# EAGLE design arduino_drivershield_1l (EAGLE 6.2)
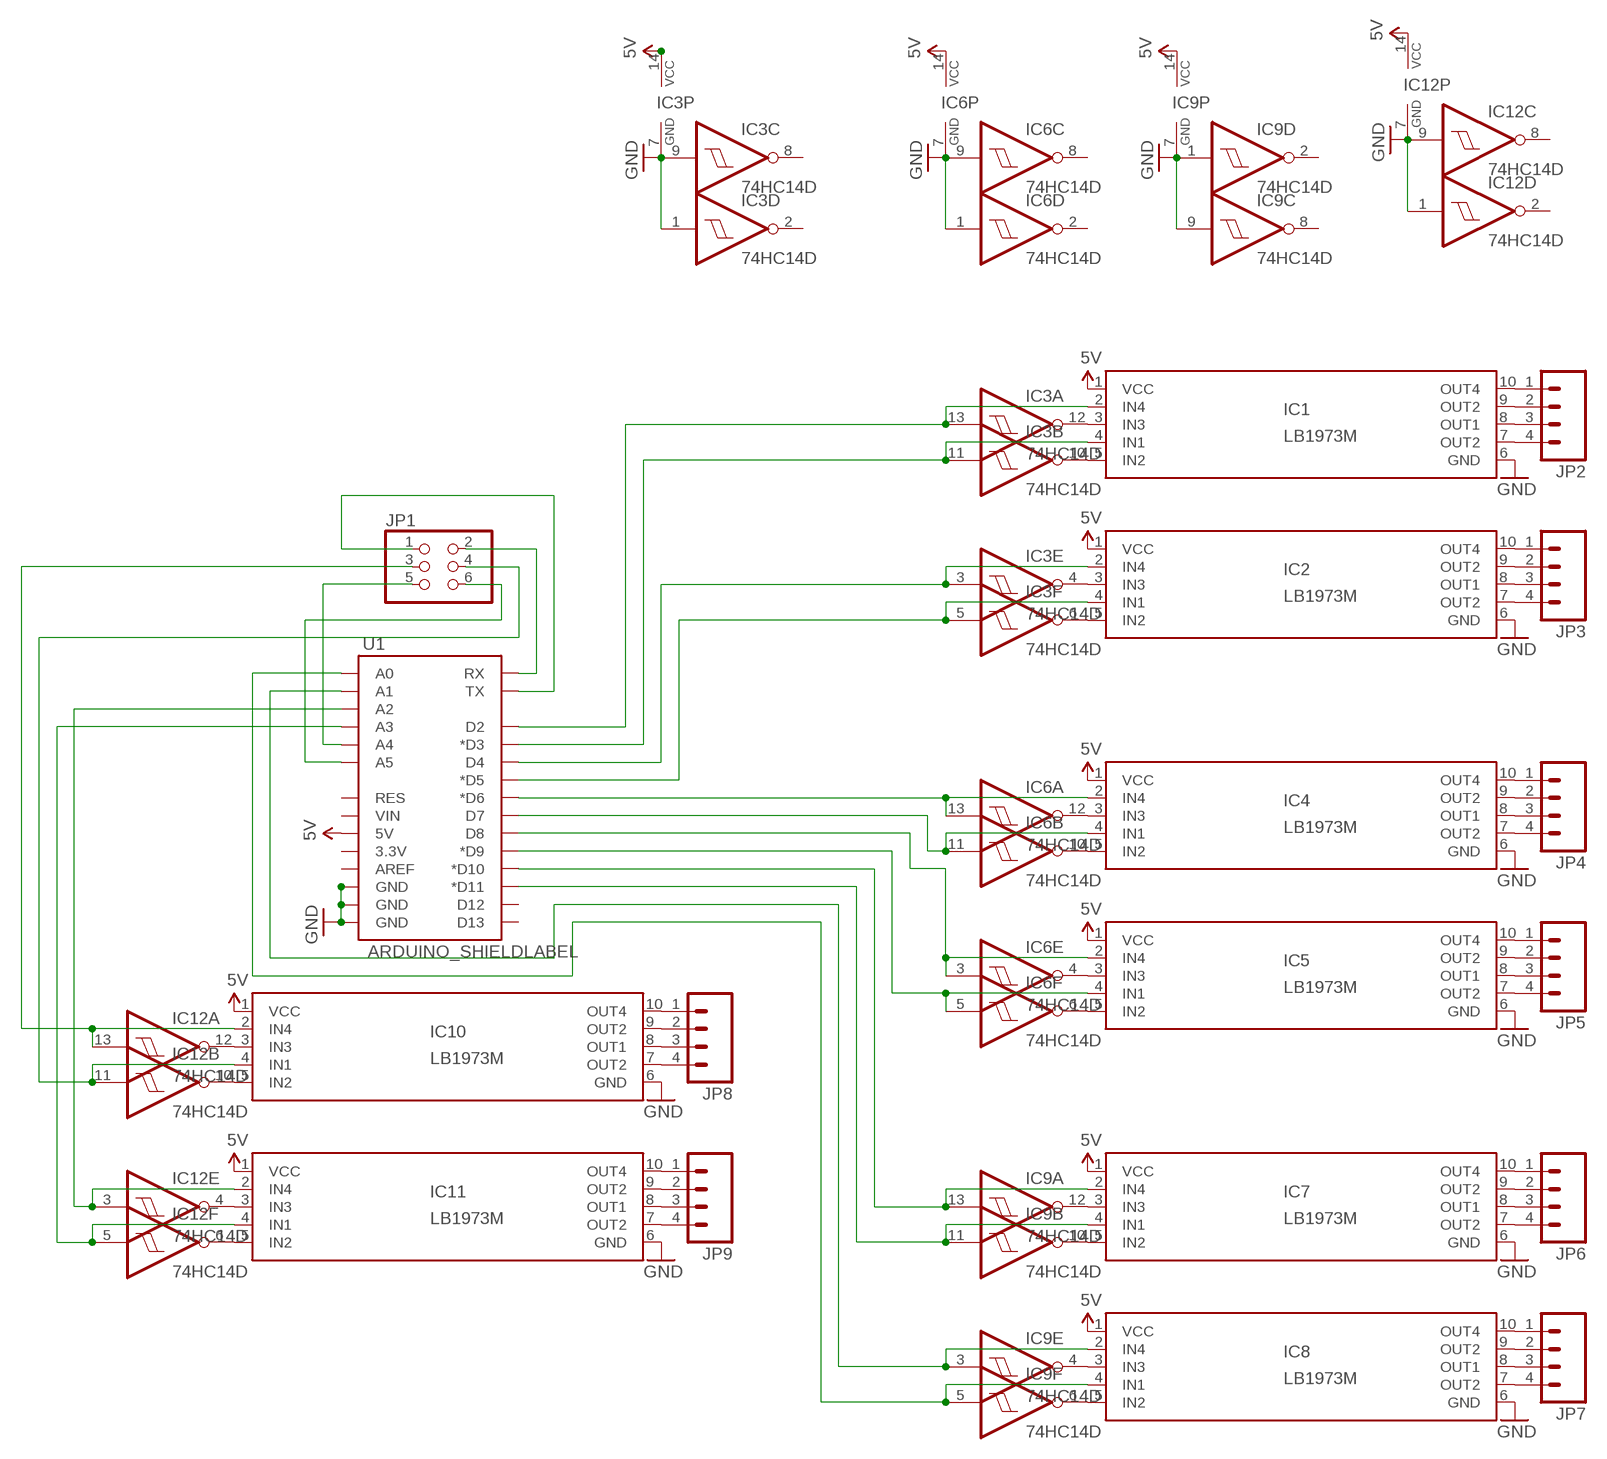
[diagram p0: schematic, sheet 1]

## Parts
IC1  LB1973M  [SSOP10]
IC2  LB1973M  [SSOP10]
IC3  74HC14D  [SO14]
IC4  LB1973M  [SSOP10]
IC5  LB1973M  [SSOP10]
IC6  74HC14D  [SO14]
IC7  LB1973M  [SSOP10]
IC8  LB1973M  [SSOP10]
IC9  74HC14D  [SO14]
IC10  LB1973M  [SSOP10]
IC11  LB1973M  [SSOP10]
IC12  74HC14D  [SO14]
JP1  PINHD-2X3  [2X03]
JP2  M041X04_NO_SILK  [1X04_NO_SILK]
JP3  M041X04_NO_SILK  [1X04_NO_SILK]
JP4  M041X04_NO_SILK  [1X04_NO_SILK]
JP5  M041X04_NO_SILK  [1X04_NO_SILK]
JP6  M041X04_NO_SILK  [1X04_NO_SILK]
JP7  M041X04_NO_SILK  [1X04_NO_SILK]
JP8  M041X04_NO_SILK  [1X04_NO_SILK]
JP9  M041X04_NO_SILK  [1X04_NO_SILK]
U1  ARDUINO_SHIELDLABEL  [DUEMILANOVE_SHIELD]

## Nets
5V: IC1.1(VCC) IC2.1(VCC) IC3.14(P:VCC) IC4.1(VCC) IC5.1(VCC) IC6.14(P:VCC) IC7.1(VCC) IC8.1(VCC) IC9.14(P:VCC) IC10.1(VCC) IC11.1(VCC) IC12.14(P:VCC) U1.5V
GND: IC1.6(GND) IC2.6(GND) IC3.1(D:I) IC3.7(P:GND) IC3.9(C:I) IC4.6(GND) IC5.6(GND) IC6.1(D:I) IC6.7(P:GND) IC6.9(C:I) IC7.6(GND) IC8.6(GND) IC9.1(D:I) IC9.7(P:GND) IC9.9(C:I) IC10.6(GND) IC11.6(GND) IC12.1(D:I) IC12.7(P:GND) IC12.9(C:I) U1.GND@0(GND) U1.GND@1(GND) U1.GND@2(GND)
N$1: IC1.7(OUT2) JP2.4
N$2: IC1.8(OUT1) JP2.3
N$3: IC1.9(OUT2) JP2.2
N$4: IC1.10(OUT4) JP2.1
N$5: IC2.7(OUT2) JP3.4
N$6: IC2.8(OUT1) JP3.3
N$7: IC2.9(OUT2) JP3.2
N$8: IC2.10(OUT4) JP3.1
N$9: IC1.3(IN3) IC3.12(A:O)
N$10: IC1.5(IN2) IC3.10(B:O)
N$11: IC2.3(IN3) IC3.4(E:O)
N$12: IC2.5(IN2) IC3.6(F:O)
N$13: IC1.4(IN1) IC3.11(B:I) U1.D3(*D3)
N$14: IC1.2(IN4) IC3.13(A:I) U1.D2
N$15: IC2.2(IN4) IC3.3(E:I) U1.D4
N$16: IC2.4(IN1) IC3.5(F:I) U1.D5(*D5)
N$17: IC4.7(OUT2) JP4.4
N$18: IC4.8(OUT1) JP4.3
N$19: IC4.9(OUT2) JP4.2
N$20: IC4.10(OUT4) JP4.1
N$21: IC5.7(OUT2) JP5.4
N$22: IC5.8(OUT1) JP5.3
N$23: IC5.9(OUT2) JP5.2
N$24: IC5.10(OUT4) JP5.1
N$25: IC4.3(IN3) IC6.12(A:O)
N$26: IC4.5(IN2) IC6.10(B:O)
N$27: IC10.2(IN4) IC12.13(A:I) JP1.3
N$28: IC8.2(IN4) IC9.3(E:I) U1.A1
N$29: IC10.4(IN1) IC12.11(B:I) JP1.4
N$30: IC11.2(IN4) IC12.3(E:I) U1.A2
N$33: IC4.4(IN1) IC6.11(B:I) U1.D7
N$34: IC4.2(IN4) IC6.13(A:I) U1.D6(*D6)
N$35: IC5.2(IN4) IC6.3(E:I) U1.D8
N$36: IC5.4(IN1) IC6.5(F:I) U1.D9(*D9)
N$37: IC5.3(IN3) IC6.4(E:O)
N$38: IC5.5(IN2) IC6.6(F:O)
N$39: IC7.7(OUT2) JP6.4
N$40: IC7.8(OUT1) JP6.3
N$41: IC7.9(OUT2) JP6.2
N$42: IC7.10(OUT4) JP6.1
N$43: IC8.7(OUT2) JP7.4
N$44: IC8.8(OUT1) JP7.3
N$45: IC8.9(OUT2) JP7.2
N$46: IC8.10(OUT4) JP7.1
N$47: IC7.3(IN3) IC9.12(A:O)
N$48: IC7.5(IN2) IC9.10(B:O)
N$49: IC7.4(IN1) IC9.11(B:I) U1.D11(*D11)
N$50: IC7.2(IN4) IC9.13(A:I) U1.D10(*D10)
N$51: IC8.4(IN1) IC9.5(F:I) U1.A0
N$53: IC8.3(IN3) IC9.4(E:O)
N$54: IC8.5(IN2) IC9.6(F:O)
N$55: IC10.7(OUT2) JP8.4
N$56: IC10.8(OUT1) JP8.3
N$57: IC10.9(OUT2) JP8.2
N$58: IC10.10(OUT4) JP8.1
N$59: IC11.7(OUT2) JP9.4
N$60: IC11.8(OUT1) JP9.3
N$61: IC11.9(OUT2) JP9.2
N$62: IC11.10(OUT4) JP9.1
N$63: IC10.3(IN3) IC12.12(A:O)
N$64: IC10.5(IN2) IC12.10(B:O)
N$66: IC11.4(IN1) IC12.5(F:I) U1.A3
N$69: IC11.3(IN3) IC12.4(E:O)
N$70: IC11.5(IN2) IC12.6(F:O)
RX: JP1.2 U1.RX
SCL: JP1.6 U1.A5
SDA: JP1.5 U1.A4
TX: JP1.1 U1.TX
Unconnected: IC3.2(D:O) IC3.8(C:O) IC6.2(D:O) IC6.8(C:O) IC9.2(D:O) IC9.8(C:O) IC12.2(D:O) IC12.8(C:O) U1.3.3V U1.AREF U1.D12 U1.D13 U1.RES U1.VIN

## Library data of the parts
IC1 IC2 IC4 IC5 IC7 IC8 IC10 IC11 = LB1973M:LB1973M: edit this description Auto generated by make-symbol-device-package-bsdl.ulp Rev. 43 Source:
IC3 IC6 IC9 IC12 = 74xx-eu:74*14: Hex schmitt trigger INVERTER
JP1 = SparkFun-Connectors:PINHD-2X3: PIN HEADER
JP2-JP9 = SparkFun-Connectors:M04: Header 4 Standard 4-pin 0.1" header. Use with straight break away headers (SKU : PRT-00116), right angle break away headers (PRT-00553), swiss pins (PRT-00743), machine pins (PRT-00117), and female headers (PRT-00115). Molex polarized connector foot print use with SKU : PRT-08231 with associated crimp pins and housings. 1MM SMD Version SKU: PRT-10208
U1 = SparkFun-Boards:ARDUINO_SHIELD: Arduino shield footprint

## Board
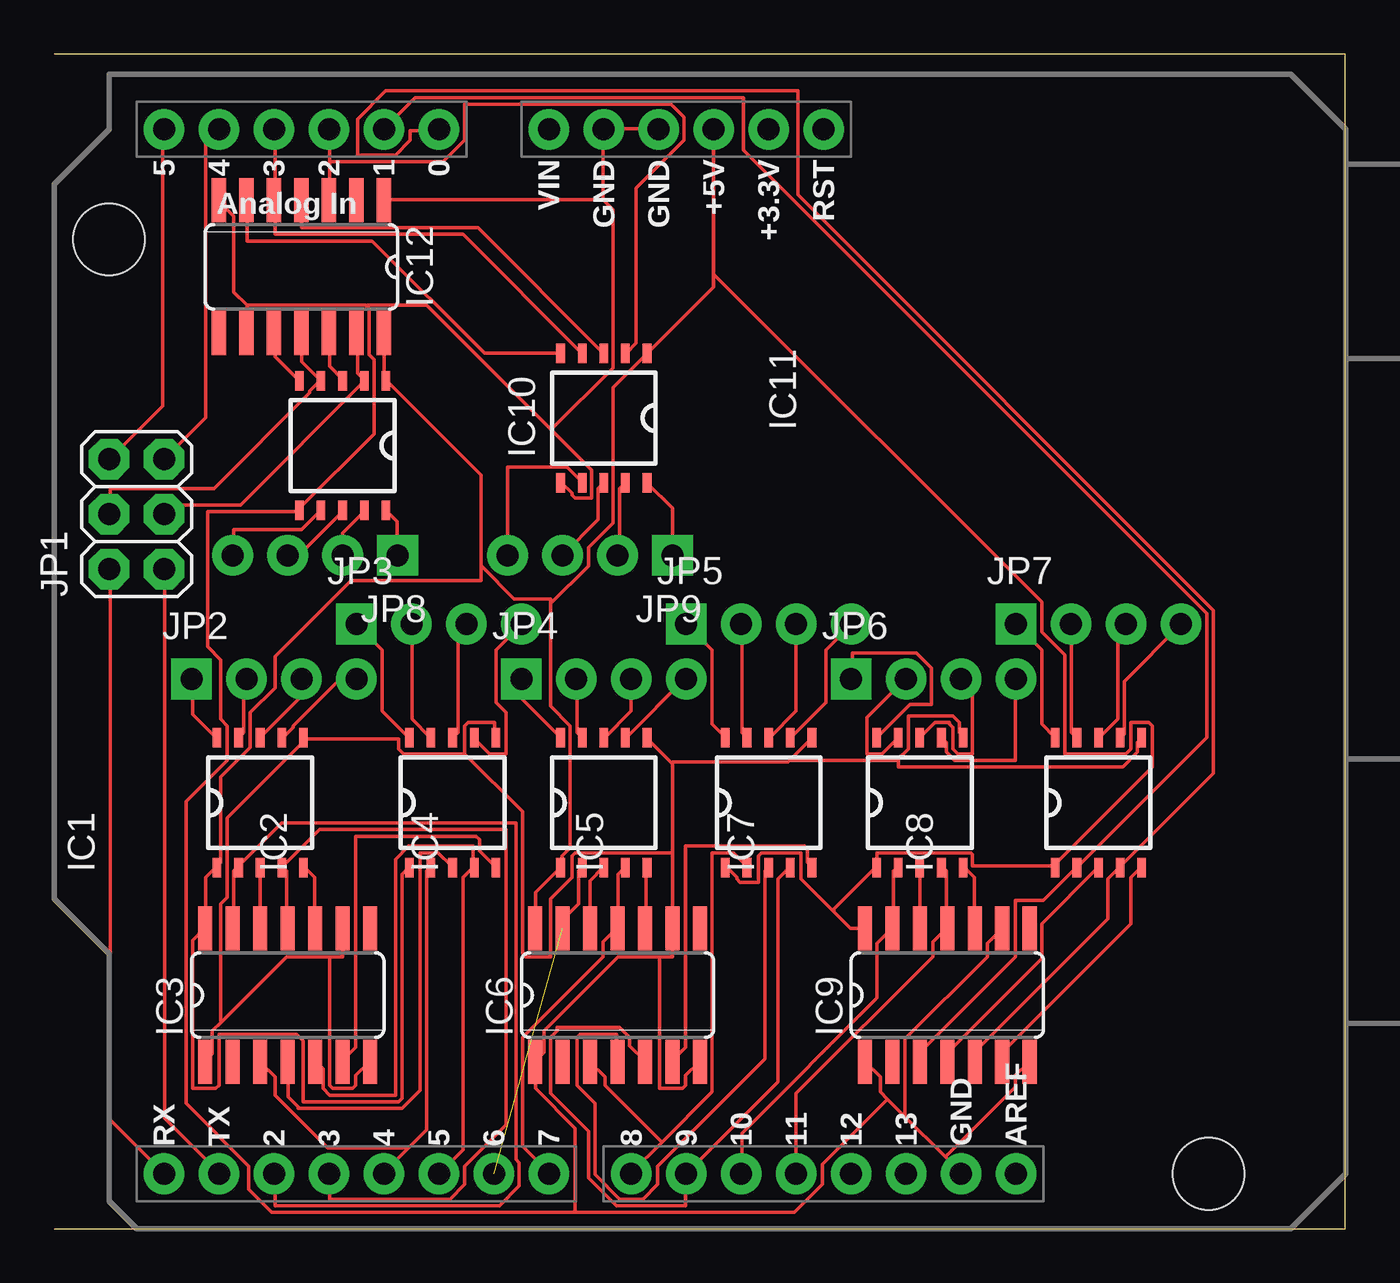
[diagram p1: board, top side]

Size 59.67 x 54.28 mm. Coordinates in mm from the lower left corner, seen from the top.
Outline: 0,0 59.67,0 59.67,54.28 0,54.28
Copper layers 1: Top 0.035mm
Design rules: minimum track width 6mil, minimum drill 12mil, track to track 6mil, track to pad 6mil, pad to pad 6mil, via to via 6mil, smd to smd 0mil, copper to edge 10mil, drill to drill 10mil, minimum pad ring 10mil, minimum via ring 6mil, stop-mask expansion 2mil, vias tented up to drill 100mil, thermal gap 10mil

### Footprints (pad centres in the part's own frame; a part is rotated, then mirrored left to right if it is on the bottom)
SSOP10 = smd 0.9 x 0.4: 1 -2.996,2; 2 -2.996,1; 3 -2.996,0; 4 -2.996,-1; 5 -2.996,-2; 6 2.996,-2; 7 2.996,-1; 8 2.996,0; 9 2.996,1; 10 2.996,2
SO14 = smd 0.66 x 2.032: 1 -3.81,-3.073; 2 -2.54,-3.073; 3 -1.27,-3.073; 4 0,-3.073; 5 1.27,-3.073; 6 2.54,-3.073; 7 3.81,-3.073; 8 3.81,3.073; 9 2.54,3.073; 10 1.27,3.073; 11 0,3.073; 12 -1.27,3.073; 13 -2.54,3.073; 14 -3.81,3.073
2X03 = drill 1.016 pad 1.88 octagon: 1 -2.54,-1.27; 2 -2.54,1.27; 3 0,-1.27; 4 0,1.27; 5 2.54,-1.27; 6 2.54,1.27
1X04_NO_SILK = drill 1.016 pad 1.88 square: 1 0,0 | drill 1.016 pad 1.88: 2 2.54,0; 3 5.08,0; 4 7.62,0
DUEMILANOVE_SHIELD = drill 1.016 pad 1.88: 3.3V 50.8,26.67; 5V 50.8,29.21; A0 50.8,41.91; A1 50.8,44.45; A2 50.8,46.99; A3 50.8,49.53; A4 50.8,52.07; A5 50.8,54.61; AREF 2.54,15.24; D2 2.54,49.53; D3 2.54,46.99; D4 2.54,44.45; D5 2.54,41.91; D6 2.54,39.37; D7 2.54,36.83; D8 2.54,33.02; D9 2.54,30.48; D10 2.54,27.94; D11 2.54,25.4; D12 2.54,22.86; D13 2.54,20.32; GND@0 50.8,31.75; GND@1 50.8,34.29; GND@2 2.54,17.78; RES 50.8,24.13; RX 2.54,54.61; TX 2.54,52.07; VIN 50.8,36.83 | hole 3.302: 45.72,57.15; 2.54,6.35

### Placement (x,y rotation side)
IC1  9.53,19.68 90 top
IC2  18.41,19.68 90 top
IC3  10.79,10.79 0 top
IC4  25.4,19.68 90 top
IC5  33.02,19.68 90 top
IC6  26.04,10.79 0 top
IC7  40.01,19.68 90 top
IC8  48.26,19.68 90 top
IC9  41.27,10.79 0 top
IC10  13.34,36.2 270 top
IC11  25.4,37.47 270 top
IC12  11.43,44.45 180 top
JP1  3.81,33.02 90 top
JP2  6.35,25.4 0 top
JP3  13.97,27.94 0 top
JP4  21.59,25.4 0 top
JP5  29.21,27.94 0 top
JP6  36.83,25.4 0 top
JP7  44.45,27.94 0 top
JP8  15.88,31.11 180 top
JP9  28.57,31.11 180 top
U1  59.69,0 90 top

### Tracks (layer width: path | path; a pad name or v marks a point on that pad's centre or on a via)
5V
  Top 0.152: IC2.1 16.38,16.69 16.08,16.38 16.08,6.02 15.93,5.87 11.51,5.87 11.51,8.69 11.2,8.99 7.62,8.99 7.62,6.63 7.47,6.48 6.4,6.48 6.4,13.34 6.93,13.87 IC3.14 7.01,13.87 7.01,16.23 7.47,16.69 IC1.1 7.54,16.76 7.7,16.92 7.7,20.88 9.07,22.25 9.07,23.85 10.21,24.99 10.21,26.44 13.72,29.95 19.74,29.95 19.74,30.56 19.77,30.59 | 36.01,14.67 36.8,13.87 IC9.14 | 36.01,14.67 34.52,16.15 34.52,17.37 32.69,17.37 32.54,17.22 32.54,16 31.7,16 31.55,16.15 31.55,16.23 31.09,16.69 IC5.1 | 36.01,14.67 36.04,14.71 36.04,14.78 37.95,16.69 IC7.1 38.02,16.76 38.02,17.37 42.37,17.37 42.44,17.3 42.44,16.76 46.25,16.76 IC8.1 46.25,16.84 50.75,21.34 50.75,23.24 50.6,23.39 49.76,23.39 49.76,22.17 49.53,21.95 46.71,21.95 46.71,26.52 45.64,27.58 45.64,28.96 30.48,44.12 | U1.5V 30.48,44.12 | 30.48,44.12 30.48,43.51 27.43,40.46 IC11.1 27.36,40.39 25.83,38.86 25.83,32.61 24.69,31.47 24.69,30.63 22.94,28.88 | IC12.14 15.24,39.32 15.32,39.24 IC10.1 15.39,39.17 19.74,34.82 19.74,30.63 19.77,30.59 | IC6.14 22.25,13.87 22.25,15.54 IC4.1 23.47,16.76 23.47,17.22 23.85,17.6 23.85,23.24 22.94,24.16 22.94,28.88 | 19.77,30.59 21.26,29.11 22.94,29.11 22.94,28.88
GND
  Top 0.152: 25.38,47.55 15.24,47.55 IC12.1 | 25.38,47.55 25.38,50.75 U1.GND@1 25.45,50.83 27.89,50.83 U1.GND@0 | 23.39,34.52 IC11.6 23.47,34.44 23.93,33.98 23.93,33.91 24.08,33.76 24.84,33.76 24.84,35.05 22.97,36.92 | 11.35,33.22 IC10.6 | 14.44,42.63 14.4,42.67 8.91,42.67 | 14.44,42.63 14.55,42.52 14.55,40.39 14.78,40.16 14.78,36.73 11.35,33.3 IC10.6 | 8.91,42.67 8.91,41.38 IC12.9 | 22.97,36.92 17.22,42.67 14.48,42.67 14.44,42.63 | 8.91,42.67 8.31,43.28 8.31,46.79 7.62,47.47 IC12.7 | 25.38,47.55 25.83,47.09 25.83,39.78 22.97,36.92 | 11.51,22.71 IC1.6 | 18.97,21.95 16.15,21.95 15.93,22.17 15.93,22.63 11.58,22.63 IC1.6 | 18.97,21.95 18.97,23.24 19.13,23.39 20.34,23.39 20.34,22.71 IC2.6 20.42,22.71 | 14.63,7.77 IC3.7 14.55,7.7 13.95,7.09 13.95,6.63 13.79,6.48 12.88,6.48 12.72,6.63 12.72,12.57 | 7.73,9.56 10.74,12.57 12.72,12.57 | 7.73,9.56 7.32,9.14 7.32,8.08 7.01,7.77 IC3.1 | 12.72,12.57 13.34,12.57 IC3.9 | IC1.6 11.58,22.55 8,18.97 8,15.32 7.7,15.01 7.7,9.6 7.73,9.56 | IC9.1 38.18,7.01 38.18,6.33 38.52,5.98 | 41.19,3.31 41.91,2.59 U1.GND@2 | 41.19,3.31 39.28,5.22 | 39.28,5.22 38.52,5.98 | 41.19,3.31 44.42,6.55 44.42,7.09 45.03,7.7 IC9.7 | IC9.9 43.13,13.18 43.13,12.57 39.32,8.76 39.32,5.26 39.28,5.22 | 50.29,22.71 IC8.6 50.22,22.63 50.06,22.48 50.06,22.02 49.38,21.34 39.01,21.34 39.01,21.64 38.98,21.68 | 41.99,22.71 IC7.6 41.99,22.78 41.83,22.94 41.83,23.39 41.53,23.7 39.47,23.7 39.47,22.17 38.98,21.68 | 35.05,22.71 IC5.6 34.98,22.63 34.02,21.68 | 27.43,22.71 IC4.6 27.43,22.63 28.54,21.53 | 28.54,21.53 28.57,21.49 28.57,17.37 | 28.57,17.37 IC6.9 28.57,12.57 27.96,12.57 | 34.02,21.68 33.91,21.57 28.57,21.57 28.54,21.53
  Top 0.152: 38.98,21.68 38.94,21.64 34.06,21.64 34.02,21.68 | 27.96,12.57 26.06,12.57 22.63,9.14 22.63,8.15 22.25,7.77 IC6.1 22.25,7.7 22.25,6.48 24.08,4.65 24.08,0.76 | 27.96,12.57 27.96,6.48 29.03,6.48 29.18,6.63 29.18,7.09 29.79,7.7 IC6.7 | 38.52,5.98 35.51,2.97 35.51,2.06 34.21,0.76 24.08,0.76 | 18.97,21.95 21.64,19.28 21.64,12.72 21.79,12.57 22.94,12.57 22.94,15.24 23.93,16.23 23.93,17.22 24.08,17.37 28.57,17.37 | 24.08,0.76 10.06,0.76 8.99,1.83 8.99,2.9 6.1,5.79 6.1,19.74 8,21.64 8,23.24 7.7,23.55 7.7,26.29 7.09,26.9 7.09,33.15 11.28,33.15 IC10.6
N$1
  Top 0.152: IC1.7 10.59,22.71 11.05,23.16 11.05,23.24 13.18,25.38 13.95,25.38 JP2.4
N$2
  Top 0.152: JP2.3 11.43,24.61 9.53,22.71 IC1.8
N$3
  Top 0.152: IC1.9 8.53,22.71 8.76,22.94 8.76,25.3 8.84,25.38 JP2.2
N$4
  Top 0.152: IC1.10 7.47,22.71 6.4,23.77 6.4,25.38 JP2.1
N$5
  Top 0.152: IC2.7 19.43,22.63 20.12,21.95 20.88,21.95 20.88,23.85 20.42,24.31 20.42,26.75 21.57,27.89 JP3.4
N$6
  Top 0.152: IC2.8 18.44,22.71 18.67,22.94 18.67,27.51 19.05,27.89 JP3.3
N$7
  Top 0.152: IC2.9 17.37,22.71 16.54,23.55 16.54,27.89 JP3.2
N$8
  Top 0.152: JP3.1 15.16,26.75 15.16,23.93 16.38,22.71 IC2.10
N$9
  Top 0.152: IC3.12 IC1.3
N$10
  Top 0.152: IC1.5 11.58,16.69 12.04,16.23 12.04,13.87 IC3.10
N$11
  Top 0.152: IC2.3 18.36,16.76 17.75,17.37 16.92,17.37 16.92,6.4 16.08,5.56 11.28,5.56 11.28,5.64 10.82,6.1 10.82,7.7 IC3.4
N$12
  Top 0.152: IC2.5 20.34,16.76 19.66,17.45 19.66,17.98 19.51,18.14 13.95,18.14 13.95,8.38 13.34,7.77 IC3.6
N$13
  Top 0.152: IC3.11 10.74,13.87 10.74,16.54 10.59,16.69 IC1.4 10.59,16.76 12.27,18.44 20.88,18.44 20.88,4.8 18.97,2.9 18.97,2.06 18.29,1.37 12.72,1.37 12.72,2.52 U1.D3
N$14
  Top 0.152: IC3.13 8.31,13.87 8.31,16.54 8.46,16.69 IC1.2 8.53,16.76 10.52,18.75 21.34,18.75 21.34,3.2 21.49,3.05 21.49,1.98 20.57,1.07 10.21,1.07 10.21,2.52 U1.D2
N$15
  Top 0.152: 16.34,3.7 15.24,2.59 U1.D4 | 16.34,3.7 17.22,4.57 17.22,16.54 17.37,16.69 IC2.2 | IC3.3 9.53,7.7 10.21,7.01 10.21,6.17 12.65,3.73 16.31,3.73 16.34,3.7
N$16
  Top 0.152: U1.D5 18.9,3.66 18.9,16.23 19.36,16.69 IC2.4 19.36,16.76 19.36,17.68 16.38,17.68 15.77,17.07 15.77,6.17 12.72,6.17 12.42,6.48 12.42,7.39 12.12,7.7 IC3.5
N$17
  Top 0.152: IC4.7 26.44,22.71 29.18,25.45 JP4.4
N$18
  Top 0.152: JP4.3 26.67,23.93 25.45,22.71 IC4.8
N$19
  Top 0.152: IC4.9 24.38,22.71 24.16,22.94 24.16,25.38 JP4.2
N$20
  Top 0.152: IC4.10 23.39,22.71 21.64,24.46 21.64,25.38 JP4.1
N$21
  Top 0.152: IC5.7 34.06,22.71 35.66,24.31 35.66,26.75 36.8,27.89 JP5.4
N$22
  Top 0.152: JP5.3 34.29,23.93 33.07,22.71 IC5.8
N$23
  Top 0.152: IC5.9 32,22.71 31.77,22.94 31.77,27.89 JP5.2
N$24
  Top 0.152: JP5.1 30.4,26.75 30.4,23.32 31.01,22.71 IC5.10
N$25
  Top 0.152: IC6.12 24.77,16.08 25.38,16.69 IC4.3
N$26
  Top 0.152: IC4.5 27.36,16.69 27.36,13.87 IC6.10
N$27
  Top 0.152: IC12.13 14.02,41.38 14.02,39.55 14.33,39.24 IC10.2 14.33,39.17 8.61,33.45 5.11,33.45 5.11,33.07 JP1.3
N$28
  Top 0.152: IC9.3 40.01,8.15 44.42,12.57 44.42,15.16 45.72,15.16 47.24,16.69 IC8.2 47.32,16.76 53.26,22.71 53.26,28.42 31.85,49.84 31.85,52.27 16.69,52.27 15.24,50.83 U1.A1
N$29
  Top 0.152: IC12.11 11.43,40.08 12.27,39.24 IC10.4 12.27,39.17 11.81,38.71 11.81,38.63 7.39,34.21 2.59,34.21 2.59,33.07 JP1.4
N$30
  Top 0.152: 12.72,49.3 17.98,49.3 18.97,50.29 18.97,51.97 28.5,51.97 29.11,51.36 29.11,50.29 26.9,48.08 26.9,40.92 26.44,40.46 IC11.2 | 12.72,49.3 12.72,50.75 U1.A2 | 12.72,49.3 12.72,47.55 IC12.3
N$33
  Top 0.152: IC4.4 26.36,16.69 26.06,16.38 26.06,13.87 IC6.11 25.98,13.87 25.38,13.26 25.38,12.57 21.64,8.84 21.64,3.81 22.86,2.59 U1.D7
N$34  (1 unrouted)
  Top 0.152: IC4.2 24.38,16.69 24.23,16.54 24.23,15.01 23.55,14.33 23.55,13.87 IC6.13
N$35
  Top 0.152: 28.08,4 26.67,2.59 U1.D8 | 28.08,4 30.4,6.33 30.4,17.37 31.39,17.37 32,16.76 IC5.2 | 28.08,4 25.45,6.63 25.45,7.01 24.77,7.7 IC6.3
N$36
  Top 0.152: IC5.4 33.98,16.69 33.45,16.15 33.45,6.78 U1.D9 29.18,2.52 29.18,1.07 25.98,1.07 24.69,2.36 24.69,4.5 22.94,6.25 22.94,8.84 23.24,9.14 23.24,9.3 26.14,9.3 26.59,8.84 26.59,8.46 27.28,7.77 IC6.5
N$37
  Top 0.152: IC5.3 32.99,16.69 32.84,16.54 32.84,7.85 27.89,2.9 27.89,2.06 27.2,1.37 26.14,1.37 24.99,2.52 24.99,5.79 24.16,6.63 24.16,8.84 24.31,8.99 25.98,8.99 25.98,7.77 IC6.4
N$38
  Top 0.152: IC5.5 34.98,16.76 34.82,16.92 34.82,17.53 34.67,17.68 29.18,17.68 29.18,8.38 28.57,7.77 IC6.6
N$39
  Top 0.152: IC7.7 41.07,22.63 41.22,22.48 41.22,22.02 41.6,21.64 44.42,21.64 44.42,25.38 JP6.4
N$40
  Top 0.152: IC7.8 40.01,22.71 40.69,23.39 41.38,23.39 41.38,23.32 41.53,23.16 41.53,22.17 41.76,21.95 42.44,21.95 42.44,24.84 41.91,25.38 JP6.3
N$41
  Top 0.152: IC7.9 38.94,22.63 38.25,21.95 37.57,21.95 37.57,23.62 39.32,25.38 JP6.2
N$42
  Top 0.152: IC7.10 38.02,22.71 39.55,24.23 40.54,24.23 40.54,25.91 39.85,26.59 36.88,26.59 36.88,25.45 JP6.1
N$43
  Top 0.152: IC8.7 49.3,22.71 49.45,22.86 49.45,25.3 52.05,27.89 JP7.4
N$44
  Top 0.152: IC8.8 48.31,22.71 49.15,23.55 49.15,27.51 49.53,27.89 JP7.3
N$45
  Top 0.152: IC8.9 47.24,22.71 47.02,22.94 47.02,27.89 JP7.2
N$46
  Top 0.152: JP7.1 45.64,26.75 45.64,23.32 46.25,22.71 IC8.10
N$47
  Top 0.152: IC9.12 IC7.3
N$48
  Top 0.152: IC7.5 42.06,16.69 42.52,16.23 42.52,13.87 IC9.10
N$49
  Top 0.152: 41.22,13.87 41.22,16.54 41.07,16.69 IC7.4 | 41.22,13.87 40.62,13.26 40.62,12.57 34.29,6.25 U1.D11 | 41.22,13.87 IC9.11
N$50
  Top 0.152: IC7.2 38.94,16.69 38.79,16.54 38.79,13.87 IC9.13 38.71,13.87 38.02,13.18 38.02,10.67 31.77,4.42 31.77,2.59 U1.D10
N$51
  Top 0.152: IC9.5 42.6,7.77 42.6,8.23 48.69,14.33 48.69,16.15 49.23,16.69 IC8.4 49.3,16.76 53.57,21.03 53.57,28.57 34.37,47.78 34.37,52.58 15.32,52.58 14.02,51.28 14.02,49.61 15.77,49.61 16.46,50.29 16.46,50.75 17.75,50.75 U1.A0
N$53
  Top 0.152: IC8.3 48.23,16.69 45.64,14.1 45.64,12.5 41.3,8.15 41.3,7.77 IC9.4
N$54
  Top 0.152: IC9.6 43.81,8.15 49.76,14.1 49.76,16.23 50.22,16.69 IC8.5
N$55
  Top 0.152: IC10.7 12.27,33.15 11.43,32.31 8.31,32.31 8.31,31.17 JP8.4
N$56
  Top 0.152: IC10.8 13.34,33.15 11.35,31.17 10.82,31.17 JP8.3
N$57
  Top 0.152: JP8.2 13.34,32.16 14.33,33.15 IC10.9
N$58
  Top 0.152: IC10.10 15.39,33.15 15.85,32.69 15.85,31.17 JP8.1
N$59
  Top 0.152: JP9.4 20.95,35.2 23.7,35.2 24.38,34.52 IC11.7
N$60
  Top 0.152: JP9.3 25.15,32.77 25.15,34.21 25.38,34.44 IC11.8
N$61
  Top 0.152: IC11.9 26.36,34.44 26.14,34.21 26.14,31.24 26.06,31.17 JP9.2
N$62
  Top 0.152: JP9.1 28.57,33.3 27.43,34.44 IC11.10
N$63
  Top 0.152: IC10.3 13.34,39.24 12.72,39.85 12.72,41.38 IC12.12
N$64
  Top 0.152: IC10.5 11.28,39.24 10.21,40.31 10.21,41.38 IC12.10
N$66
  Top 0.152: IC11.4 24.38,40.46 18.9,45.95 10.21,45.95 10.21,47.47 IC12.5 10.21,47.55 10.21,50.75 U1.A3
N$69
  Top 0.152: IC12.4 11.43,46.25 19.58,46.25 25.38,40.46 IC11.3
N$70
  Top 0.152: IC11.5 19.89,40.46 14.71,45.64 8.91,45.64 8.91,47.47 IC12.6
RX
  Top 0.152: U1.RX 2.59,5.03 2.59,30.48 JP1.2
SCL
  Top 0.152: JP1.6 2.59,35.59 5.03,38.02 5.03,50.75 U1.A5
SDA
  Top 0.152: JP1.5 7.01,37.49 7.01,50.14 7.62,50.75 U1.A4
TX
  Top 0.152: U1.TX 7.62,2.59 5.11,5.11 5.11,30.48 JP1.1